# Altium project Dart_Controller.PrjPcb
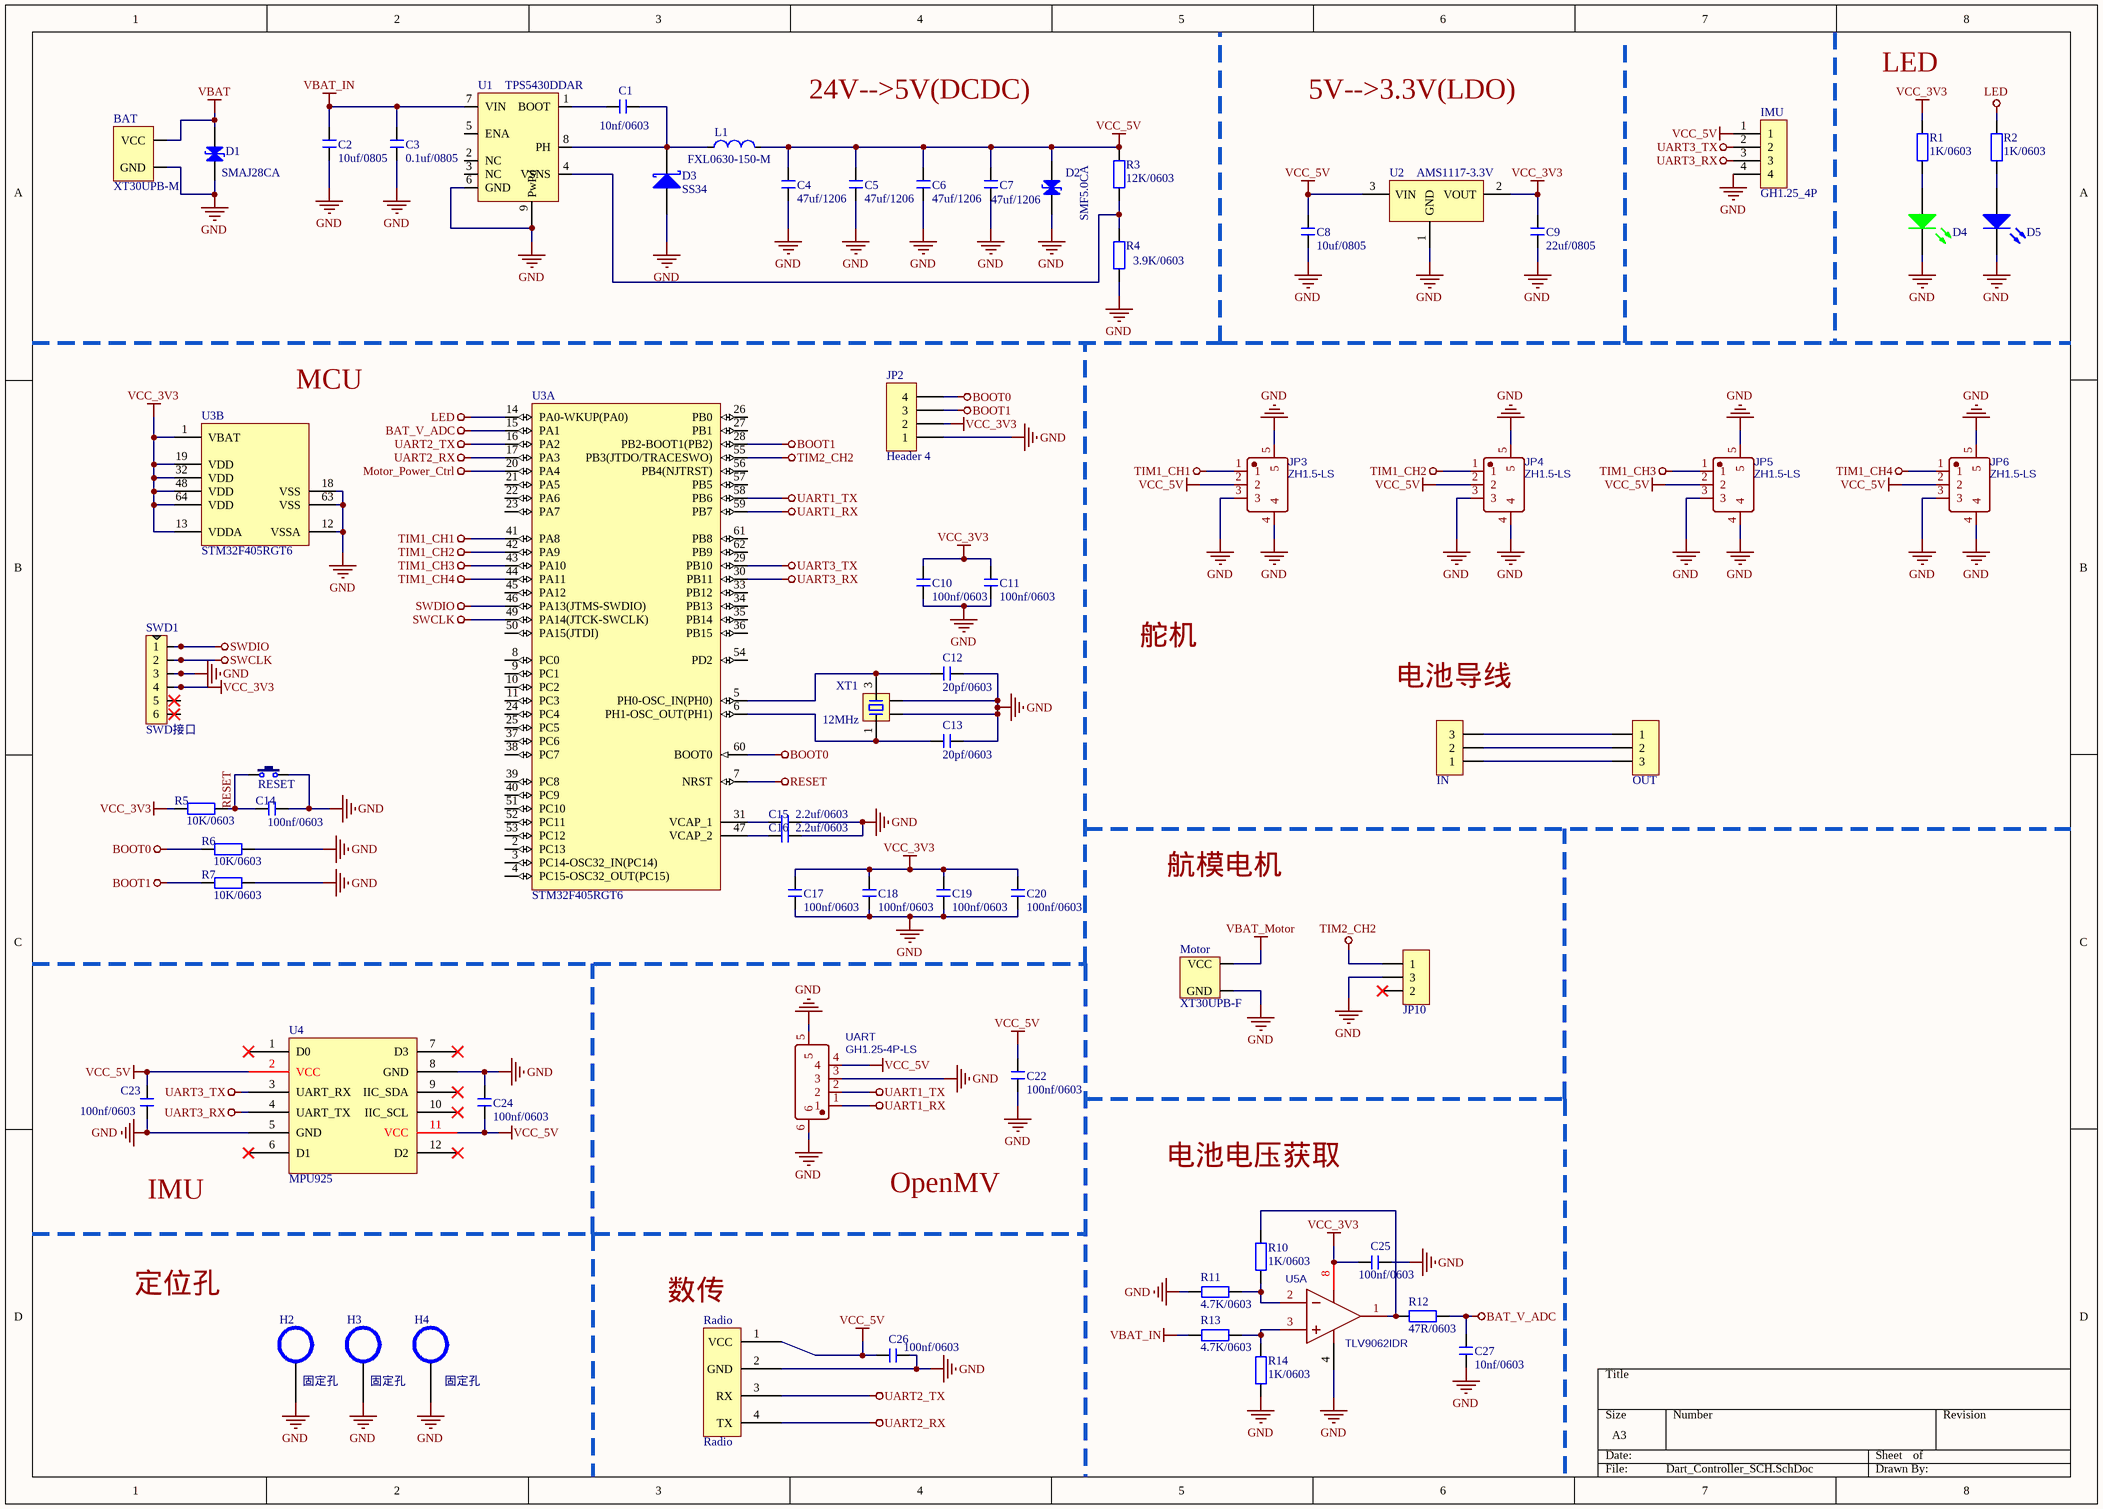
[diagram p0: Dart_Controller_SCH.SchDoc]
2 sheets, 76 parts. Net scope: global (net labels, ports and power ports of the same name join across sheets).
Board file: Dart_Controller_PCB.PcbDoc
Sheets:
  Dart_Controller_SCH.SchDoc
  Dart_Controller_SCH2.SchDoc

## Sheet Dart_Controller_SCH.SchDoc
size A3; SheetNumber: 2; SheetTotal: 3

### Parts
BAT  XT30UPB-M  [XT30PW-M]
C1  10nf/0603  [C 0603_M]
C2  10uf/0805  [C 0805_M]
C3  0.1uf/0805  [C 0805_M]
C4  47uf/1206  [C 1206_M]
C5  47uf/1206  [C 1206_M]
C6  47uf/1206  [C 1206_M]
C7  47uf/1206  [C 1206_M]
C8  10uf/0805  [C 0805_M]
C9  22uf/0805  [C 0805_M]
C10  100nf/0603  [C 0603_M]
C11  100nf/0603  [C 0603_M]
C12  20pf/0603  [C 0603_M]
C13  20pf/0603  [C 0603_M]
C14  100nf/0603  [C 0603_M]
C15  2.2uf/0603  [C 0603_M]
C16  2.2uf/0603  [C 0603_M]
C17  100nf/0603  [C 0603_M]
C18  100nf/0603  [C 0603_M]
C19  100nf/0603  [C 0603_M]
C20  100nf/0603  [C 0603_M]
C22  100nf/0603  [C 0603_M]
C23  100nf/0603  [C 0603_M]
C24  100nf/0603  [C 0603_M]
C25  100nf/0603  [C 0603_M]
C26  100nf/0603  [C 0603_M]
C27  10nf/0603  [C 0603_M]
D1  SMAJ28CA  [SMA]
D2  SMF5.0CA  [SOD-123FL_L2.8-W1.8-LS3.7-BI]
D3  SS34  [SMA]
D4  LED_G/0603  [LED-0603G]  (value not drawn)
D5  LED_B/0603  [LED-0603B]  (value not drawn)
H2  固定孔  [铜柱孔]
H3  固定孔  [铜柱孔]
H4  固定孔  [铜柱孔]
IMU  GH1.25_4P  [GH1.25-WS-4P]
IN  HDR-1X3  [XH2.54-LI-3P]  (value not drawn)
JP2  Header 4  [HDR2.54-LI-4P]
JP3  ZH1.5-LS  [ZH1.5]
JP4  ZH1.5-LS  [ZH1.5]
JP5  ZH1.5-LS  [ZH1.5]
JP6  ZH1.5-LS  [ZH1.5]
JP10  Header 2  [HDR2.54-WI-3P]  (value not drawn)
L1  FXL0630-150-M  [L-SMD-0630]
Motor  XT30UPB-F  [XT30PW-F]
OUT  HDR-1X3  [XH2.54-WI-3P]  (value not drawn)
R1  1K/0603  [R 0603_M]
R2  1K/0603  [R 0603_M]
R3  12K/0603  [R 0603_M]
R4  3.9K/0603  [R 0603_M]
R5  10K/0603  [R 0603_M]
R6  10K/0603  [R 0603_M]
R7  10K/0603  [R 0603_M]
R10  1K/0603  [R 0603_M]
R11  4.7K/0603  [R 0603_M]
R12  47R/0603  [R 0603_M]
R13  4.7K/0603  [R 0603_M]
R14  1K/0603  [R 0603_M]
Radio  Radio  [Radio]
RESET  3x6x5  [TSW SMD-3*6*2.5]  (value not drawn)
SWD1  SWD接口  [MX 1.25-WS-4P]
U1  TPS5430DDAR  [ESOP8]
U2  AMS1117-3.3V  [SOT-89]
U3  STM32F405RGT6  [LQFP64 10x10_N]  (parts A,B of 2)
U4  MPU925  [JY901B_MPU9250]
U5  TLV9062IDR  [SOP8_N]  (part A of 2)
UART  GH1.25-4P-LS  [GH1.25-LS-4P]
XT1  12MHz  [XTAL_3225_4P]

### Nets
BAT_V_ADC: C27.2 R12.2 U3.15(PA1)
BOOT0: JP2.4 R6.2 U3.60(BOOT0)
BOOT1: JP2.3 R7.2 U3.28(PB2-BOOT1(PB2))
GND: BAT.2(GND) C2.1 C3.1 C4.1 C5.1 C6.1 C7.1 C8.1 C9.1 C10.1 C11.1 C12.2 C13.2 C14.1 C15.2 C16.2 C17.1 C18.1 C19.1 C20.1 C22.2 C23.1 C24.2 C25.1 C26.2 C27.1 D1.2 D2.2 D3.1(A) D4.K D5.K H2.1 H3.1 H4.1 IMU.4 JP2.1 JP3.3 JP3.4 JP3.5 JP4.3 JP4.4 JP4.5 JP5.3 JP5.4 JP5.5 JP6.3 JP6.4 JP6.5 JP10.3 Motor.2(GND) R4.1 R6.1 R7.1 R11.1 R14.1 Radio.2(GND) RESET.2 SWD1.3 U1.6(GND) U1.9(PwPd) U2.1(GND) U3.12(VSSA) U3.18(VSS) U3.63(VSS) U4.5(GND) U4.8(GND) U5.4(VS-) UART.3 UART.5 UART.6 XT1.2 XT1.4
LED: R2.2 U3.14(PA0-WKUP(PA0))
Motor_Power_Ctrl: U3.20(PA4)
RESET: C14.2 R5.1 RESET.1 U3.7(NRST)
SWCLK: SWD1.2 U3.49(PA14(JTCK-SWCLK))
SWDIO: SWD1.1 U3.46(PA13(JTMS-SWDIO))
TIM1_CH1: JP3.1 U3.41(PA8)
TIM1_CH2: JP4.1 U3.42(PA9)
TIM1_CH3: JP5.1 U3.43(PA10)
TIM1_CH4: JP6.1 U3.44(PA11)
TIM2_CH2: JP10.1 U3.55(PB3(JTDO/TRACESWO))
UART1_RX: U3.59(PB7) UART.1
UART1_TX: U3.58(PB6) UART.2
UART2_RX: Radio.4(TX) U3.17(PA3)
UART2_TX: Radio.3(RX) U3.16(PA2)
UART3_RX: IMU.3 U3.30(PB11) U4.4(UART_TX)
UART3_TX: IMU.2 U3.29(PB10) U4.3(UART_RX)
VBAT: BAT.1(VCC) D1.1
VBAT_IN: C2.2 C3.2 R13.1 U1.7(VIN)
VBAT_Motor: Motor.1(VCC)
VCC_3V3: C9.2 C10.2 C11.2 C17.2 C18.2 C19.2 C20.2 C25.2 JP2.2 R1.2 R5.2 SWD1.4 U2.2(VOUT) U3.1(VBAT) U3.13(VDDA) U3.19(VDD) U3.32(VDD) U3.48(VDD) U3.64(VDD) U5.8(VS+)
VCC_5V: C4.2 C5.2 C6.2 C7.2 C8.2 C22.1 C23.2 C24.1 C26.1 D2.1 IMU.1 JP3.2 JP4.2 JP5.2 JP6.2 L1.2 R3.2 Radio.1(VCC) U2.3(VIN) U4.2(VCC) U4.11(VCC) UART.4
NetC1_1: C1.1 D3.2(K) L1.1 U1.8(PH)
NetC1_2: C1.2 U1.1(BOOT)
NetC12_1: C12.1 U3.5(PH0-OSC_IN(PH0)) XT1.3
NetC13_1: C13.1 U3.6(PH1-OSC_OUT(PH1)) XT1.1
NetC15_1: C15.1 U3.31(VCAP_1)
NetC16_1: C16.1 U3.47(VCAP_2)
NetD4_A: D4.A R1.1
NetD5_A: D5.A R2.1
NetIN_1: IN.1 OUT.3
NetIN_2: IN.2 OUT.2
NetIN_3: IN.3 OUT.1
NetR3_1: R3.1 R4.2 U1.4(VSNS)
NetR10_1: R10.1 R11.2 U5.2(IN-)
NetR10_2: R10.2 R12.1 U5.1(OUT)
NetR13_2: R13.2 R14.2 U5.3(IN+)

Not connected (* = marked no-connect by the designer): JP10 2*; SWD1 5 6; U1 2(NC) 3(NC) 5(ENA); U3 2(PC13) 3(PC14-OSC32_IN(PC14)) 4(PC15-OSC32_OUT(PC15)) 8(PC0) 9(PC1) 10(PC2) 11(PC3) 21(PA5) 22(PA6) 23(PA7) 24(PC4) 25(PC5) 26(PB0) 27(PB1) 33(PB12) 34(PB13) 35(PB14) 36(PB15) 37(PC6) 38(PC7) 39(PC8) 40(PC9) 45(PA12) 50(PA15(JTDI)) 51(PC10) 52(PC11) 53(PC12) 54(PD2) 56(PB4(NJTRST)) 57(PB5) 61(PB8) 62(PB9); U4 1(D0)* 6(D1)* 7(D3)* 9(IIC_SDA)* 10(IIC_SCL)* 12(D2)*

### Notes on the sheet
- 24V-->5V(DCDC)
- 5V-->3.3V(LDO)
- LED
- (near U3) MCU
- 舵机
- (near IN) 电池导线
- 航模电机
- 电池电压获取
- IMU
- OpenMV
- 定位孔
- 数传

### Library data of the parts
BAT = XT30-PW-M: 公头(立式）
C1 C10-C20 C22-C27 = C 0603: 贴片电容; BOM名称: 无极性贴片电容; 淘宝ID: 封装库来自淘宝 ID：黄晶宝石; 联系售后: https://shop463601444.taobao.com
C2 C3 C8 C9 = C 0805: 贴片电容; BOM名称: 无极性贴片电容; 淘宝ID: 封装库来自淘宝 ID：黄晶宝石; 联系售后: https://shop463601444.taobao.com
C4-C7 = C 1206: 贴片电容; BOM名称: 无极性贴片电容; 淘宝ID: 封装库来自淘宝 ID：黄晶宝石; 联系售后: https://shop463601444.taobao.com
D1 = SMAJ28CA: 双向瞬态电压抑制二极管
D2 = SMF5.0CA: 双向瞬态电压抑制二极管
D3 = SS34: 肖特基二极管; BOM名称: 肖特基二极管; 学习资源: https://shop463601444.taobao.com
D4 = LED_G_1: 发光二极管; Published: 8-Jun-2000; LatestRevisionDate: 08-Jul-2005; LatestRevisionNote: Mech Layer 1 removed.; PackageReference: LED-0; Publisher: Altium Limited
D5 = LED_B_1: 发光二极管; Published: 8-Jun-2000; LatestRevisionDate: 08-Jul-2005; LatestRevisionNote: Mech Layer 1 removed.; PackageReference: LED-0; Publisher: Altium Limited
H2-H4 = 铜柱孔
IMU = GH1.25_4P: GH1,25_4P
IN = Header 3_1: 3P接插件; 版权归属: 封装库来自淘宝 ID：黄晶宝石; BOM名称: 3P接插件; 学习资源: https://shop463601444.taobao.com
JP2 = Header 4: Header, 4-Pin; LatestRevisionDate: 17-Jul-2002; LatestRevisionNote: Re-released for DXP Platform.; Publisher: Altium Limited
JP3-JP6 = ZH1.5-LS: Manufacturer: HCTL(华灿天禄); Manufacturer Part: HC-ZH-3PLT; Contributor: LCSC; Supplier: LCSC; Supplier Part: C2845434; JLCPCB Part Class: Extended Part; spicePre: C; spiceSymbolName: HC-ZH-3PLT
JP10 = Header 3_3: 3P接插件; 版权归属: 封装库来自淘宝 ID：黄晶宝石; BOM名称: 3P接插件; 学习资源: https://shop463601444.taobao.com
L1 = FXL0630-150-M: 功率电感
Motor = XT30-PW-F: 母头（卧式）
OUT = Header 3: 3P接插件; 版权归属: 封装库来自淘宝 ID：黄晶宝石; BOM名称: 3P接插件; 学习资源: https://shop463601444.taobao.com
R1-R7 R10-R14 = R 0603: 贴片电阻; 版权归属: 来自淘宝 ID：黄晶宝石; BOM名称: 贴片电阻; 联系售后: https://shop463601444.taobao.com
Radio = Radio: 无线电-匿名数传
RESET = TSW 3x6: 3x6轻触开关; 版权归属: 封装库来自淘宝 ID：黄晶宝石; BOM名称: 3x6轻触开关; 学习资源: www.ooocke.com
SWD1 = SWD接口: 4P
U1 = TPS5430DDAR: 降压芯片
U2 = AMS1117-3.3V(SOT-89): LDO; BOM名称: 稳压芯片; 淘宝ID: 封装库来自淘宝 ID：黄晶宝石; 欢迎光临淘宝店铺: https://shop463601444.taobao.com
U3 = STM32F405RGT6: ARM Cortex-M4 32-bit MCU+FPU, 210 DMIPS, 1024 kB Flash, 192 kB Internal RAM, 51 I/Os, 64-pin LQFP, -40 to 85 degC, Tray; Manufacturer: STMicroelectronics; D/A Converter: 2x12-bit; FLASH Size (Prog) (kB): 1024; I/Os (High Current): 51; Internal RAM Size (kB): 192; Operating Frequency(F) (Processor speed) (MHz): 168; Supply Voltage(Vcc) max (V): 3.6; Supply Voltage(Vcc) min (V): 1.8; DatasheetVersion: Rev. 4; PackageVersion: Rev. 4, 06/2013; PackageReference: LQFP64; PackageDescription: 64-Pin Low Profile Quad Flat Package, 10 x 10 mm Body, 0.5 mm Pitch; Supplier 1: Digi-Key; Supplier Part Number 1: 497-11767-ND; Supplier 2: Farnell; Supplier Part Number 2: 2064363; Supplier 3: Newark; Supplier Part Number 3: 73T2329; Supplier 4: Mouser; Supplier Part Number 4: 511-STM32F405RGT6; Core: ARM Cortex-M4; Packing: Tray; Mounting Technology: Surface Mount; PartNumber: STM32F405RGT6; ComponentLink1Description: Manufacturer URL; ComponentLink1URL: http://www.st.com/web/en/home.html; ComponentLink2Description: Datasheet; ComponentLink2URL: http://www.st.com/st-web-ui/static/active/en/resource/technical/document/datasheet/DM00037051.pdf; ComponentLink3Description: Package Specification; ComponentLink3URL: http://www.st.com/st-web-ui/static/active/en/resource/technical/document/datasheet/DM00037051.pdf
U4 = IMU
U5 = TLV9062IDR: 运算放大器; Manufacturer: TI(德州仪器); Manufacturer Part: OPA365AIDBVR; Contributor: LCSC; Supplier: LCSC; Supplier Part: C96626; JLCPCB Part Class: Extended Part; spicePre: U; spiceSymbolName: OPA365AIDBVR
UART = GH1.25-4P-LS: Manufacturer: XUNPU(讯普); Manufacturer Part: WAFER-GH1.25-4PLB; Contributor: lcsc; Supplier: LCSC; Supplier Part: C3029370; JLCPCB Part Class: Extended Part; spicePre: U; spiceSymbolName: WAFER-GH1.25-4PLB
XT1 = X322512MSB4SI: 无源晶振/外接20pf负载电容

## Sheet Dart_Controller_SCH2.SchDoc
size A4; SheetNumber: 3; SheetTotal: 3
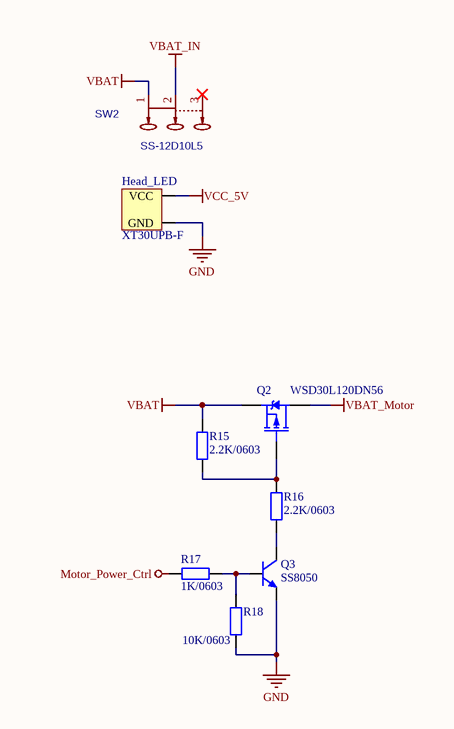
[diagram p1: Dart_Controller_SCH2.SchDoc]

### Parts
Head_LED  XT30UPB-F  [XT30PW-F]
Q2  WSD30L120DN56  [POWERVDFN-8_L6.0-W5.0-P1.27-BL]
Q3  SS8050  [SOT23-3L]
R15  2.2K/0603  [R 0603_M]
R16  2.2K/0603  [R 0603_M]
R17  1K/0603  [R 0603_M]
R18  10K/0603  [R 0603_M]
SW2  SS-12D10L5  [SW-TH_SS-12D10L5]

### Nets
GND: Head_LED.2(GND) Q3.2(E) R18.2
Motor_Power_Ctrl: R17.2
VBAT: Q2.S R15.2 SW2.1
VBAT_IN: SW2.2
VBAT_Motor: Q2.D
VCC_5V: Head_LED.1(VCC)
NetQ2_G: Q2.G R15.1 R16.2
NetQ3_1: Q3.1(B) R17.1 R18.1
NetQ3_3: Q3.3(C) R16.1

Not connected (* = marked no-connect by the designer): SW2 3*

### Library data of the parts
Head_LED = XT30-PW-F: 母头（卧式）
Q2 = WSD30L120DN56: P沟道场效应管
Q3 = SS8050-SMD: 高频放大-NPN型; 版权归属: 封装库来自淘宝 ID：黄晶宝石; 属性: 40V 1.5A 1W 100MHZ; BOM名称: 高频放大-NPN型; 联系售后: https://shop463601444.taobao.com
R15-R18 = R 0603: 贴片电阻; 版权归属: 来自淘宝 ID：黄晶宝石; BOM名称: 贴片电阻; 联系售后: https://shop463601444.taobao.com
SW2 = SS-12D10L5: 滑动开关; Manufacturer: XKB Connectivity(中国星坤); Contributor: LCSC; Supplier: LCSC; Supplier Part: C319012; Manufacturer Part: SS-12D10L5; spicePre: S; spiceSymbolName: SS-12D10L5

## Nets that join several sheets
GND: Dart_Controller_SCH (72 pins), Dart_Controller_SCH2 (Head_LED.2 Q3.2 R18.2)
Motor_Power_Ctrl: Dart_Controller_SCH (U3.20), Dart_Controller_SCH2 (R17.2)
VBAT: Dart_Controller_SCH (BAT.1 D1.1), Dart_Controller_SCH2 (Q2.S R15.2 SW2.1)
VBAT_IN: Dart_Controller_SCH (C2.2 C3.2 R13.1 U1.7), Dart_Controller_SCH2 (SW2.2)
VBAT_Motor: Dart_Controller_SCH (Motor.1), Dart_Controller_SCH2 (Q2.D)
VCC_5V: Dart_Controller_SCH (22 pins), Dart_Controller_SCH2 (Head_LED.1)